# Altium schematic sheet V1.0.SchDoc
size 147 x 241 mm; Origin: Eagle
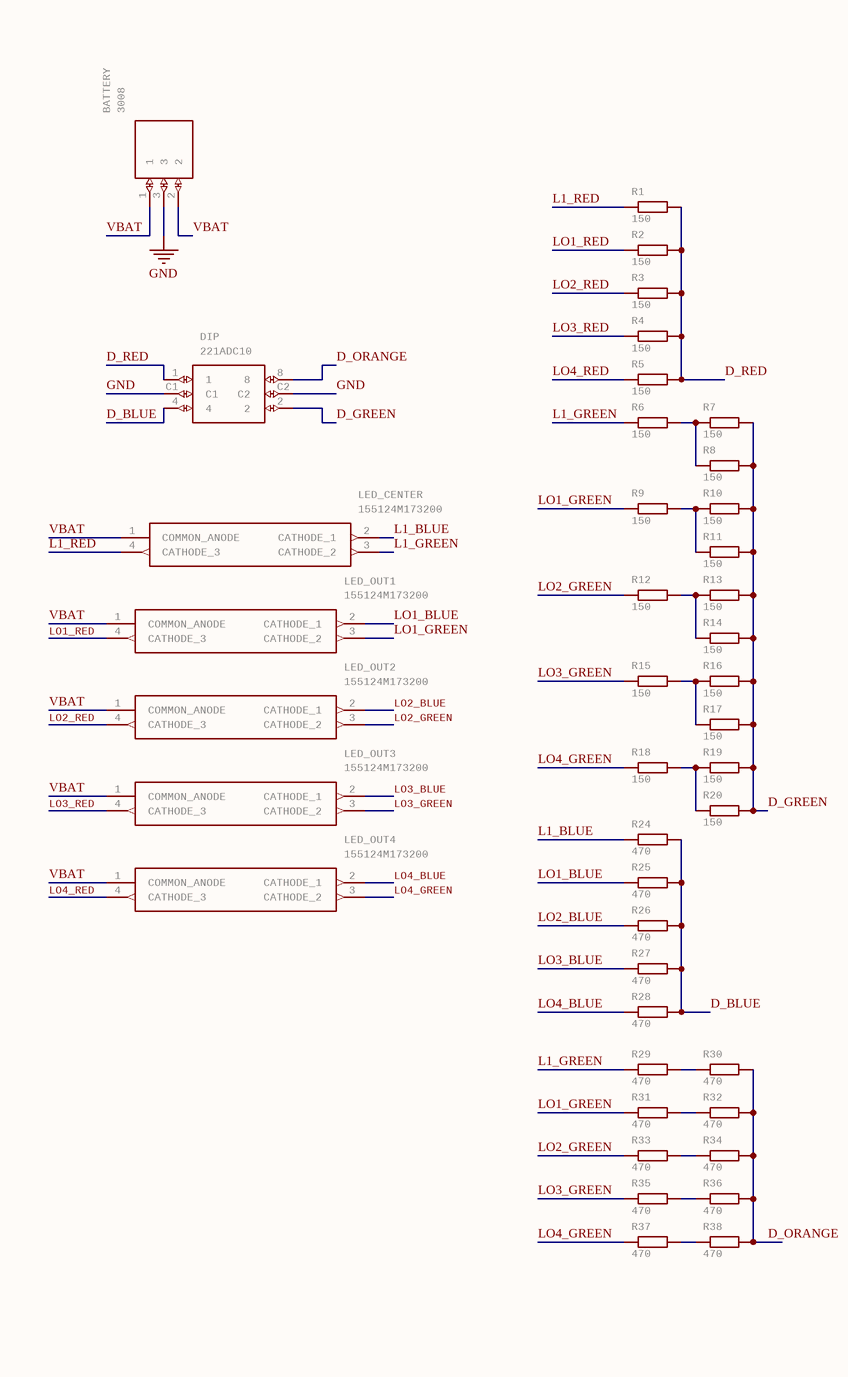
[diagram p0: V1.0.SchDoc]

## Parts
BATTERY  3008  [3008]
DIP  221ADC10  [221ADC10]
LED_CENTER  155124M173200  [155124M173200]
LED_OUT1  155124M173200  [155124M173200]
LED_OUT2  155124M173200  [155124M173200]
LED_OUT3  155124M173200  [155124M173200]
LED_OUT4  155124M173200  [155124M173200]
R1  150  [R0603]
R2  150  [R0603]
R3  150  [R0603]
R4  150  [R0603]
R5  150  [R0603]
R6  150  [R0603]
R7  150  [R0603]
R8  150  [R0603]
R9  150  [R0603]
R10  150  [R0603]
R11  150  [R0603]
R12  150  [R0603]
R13  150  [R0603]
R14  150  [R0603]
R15  150  [R0603]
R16  150  [R0603]
R17  150  [R0603]
R18  150  [R0603]
R19  150  [R0603]
R20  150  [R0603]
R24  470  [R0603]
R25  470  [R0603]
R26  470  [R0603]
R27  470  [R0603]
R28  470  [R0603]
R29  470  [R0603]
R30  470  [R0603]
R31  470  [R0603]
R32  470  [R0603]
R33  470  [R0603]
R34  470  [R0603]
R35  470  [R0603]
R36  470  [R0603]
R37  470  [R0603]
R38  470  [R0603]

## Nets
GND: BATTERY.3 DIP.C1 DIP.C2
D_BLUE: DIP.4 R24.2 R25.2 R26.2 R27.2 R28.2
D_GREEN: DIP.2 R7.2 R8.2 R10.2 R11.2 R13.2 R14.2 R16.2 R17.2 R19.2 R20.2
D_ORANGE: DIP.8 R30.2 R32.2 R34.2 R36.2 R38.2
D_RED: DIP.1 R1.2 R2.2 R3.2 R4.2 R5.2
L1_BLUE: LED_CENTER.2(CATHODE_1) R24.1
L1_GREEN: LED_CENTER.3(CATHODE_2) R6.1 R29.1
L1_RED: LED_CENTER.4(CATHODE_3) R1.1
LO1_BLUE: LED_OUT1.2(CATHODE_1) R25.1
LO1_GREEN: LED_OUT1.3(CATHODE_2) R9.1 R31.1
LO1_RED: LED_OUT1.4(CATHODE_3) R2.1
LO2_BLUE: LED_OUT2.2(CATHODE_1) R26.1
LO2_GREEN: LED_OUT2.3(CATHODE_2) R12.1 R33.1
LO2_RED: LED_OUT2.4(CATHODE_3) R3.1
LO3_BLUE: LED_OUT3.2(CATHODE_1) R27.1
LO3_GREEN: LED_OUT3.3(CATHODE_2) R15.1 R35.1
LO3_RED: LED_OUT3.4(CATHODE_3) R4.1
LO4_BLUE: LED_OUT4.2(CATHODE_1) R28.1
LO4_GREEN: LED_OUT4.3(CATHODE_2) R18.1 R37.1
LO4_RED: LED_OUT4.4(CATHODE_3) R5.1
VBAT: BATTERY.1 BATTERY.2 LED_CENTER.1(COMMON_ANODE) LED_OUT1.1(COMMON_ANODE) LED_OUT2.1(COMMON_ANODE) LED_OUT3.1(COMMON_ANODE) LED_OUT4.1(COMMON_ANODE)
NetR6_2: R6.2 R7.1 R8.1
NetR9_2: R9.2 R10.1 R11.1
NetR12_2: R12.2 R13.1 R14.1
NetR15_2: R15.2 R16.1 R17.1
NetR18_2: R18.2 R19.1 R20.1
NetR29_2: R29.2 R30.1
NetR31_2: R31.2 R32.1
NetR33_2: R33.2 R34.1
NetR35_2: R35.2 R36.1
NetR37_2: R37.2 R38.1

## Library data of the parts
BATTERY = 3008: BATTERY SOCKET   Source:  Datasheet; MANUFACTURER_NAME: Keystone Electronics; GateName_1: G$1; SymbolName_1: 3008; LibraryName: SamacSys_Parts; DeviceSetName: 3008; ARROW_PART_NUMBER: 3008; ARROW_PRICE-STOCK: https://www.arrow.com/en/products/3008/keystone-electronics; HEIGHT: 5mm; MANUFACTURER_PART_NUMBER: 3008; MOUSER_PART_NUMBER: 534-3008; MOUSER_PRICE-STOCK: https://www.mouser.co.uk/ProductDetail/Keystone-Electronics/3008?qs=Mn60vILZNNaVxpUY7xQk0w%3D%3D
DIP = 221ADC10: SWITCH ROTARY DIP BCD 100MA 50V   Source:  Datasheet; MANUFACTURER_NAME: CTS; GateName_1: G$1; SymbolName_1: 221ADC10; LibraryName: SamacSys_Parts; DeviceSetName: 221ADC10; HEIGHT: 12.06mm; MANUFACTURER_PART_NUMBER: 221ADC10; RS_PART_NUMBER: 1234573; RS_PRICE-STOCK: http://uk.rs-online.com/web/p/products/1234573
LED_CENTER LED_OUT1-LED_OUT4 = 155124M173200: WURTH ELEKTRONIK - 155124M173200 - LED, RED/GRN/BLUE, 450/850/140MCD, 1204   Source:  Datasheet; GateName_1: G$1; SymbolName_1: 155124M173200; LibraryName: SamacSys_Parts; DeviceSetName: 155124M173200; ARROW_PART_NUMBER: ARROW_PART_NUMBER; ARROW_PRICE-STOCK: ARROW_PRICE-STOCK; HEIGHT: mm; MANUFACTURER_NAME: Wurth Elektronik; MANUFACTURER_PART_NUMBER: 155124M173200; MOUSER_PART_NUMBER: 710-155124M173200; MOUSER_PRICE-STOCK: https://www.mouser.co.uk/ProductDetail/Wurth-Elektronik/155124M173200?qs=5aG0NVq1C4xPhoUU07x4gQ%3D%3D
R1-R20 R24-R38 = R-EU_R0603: RESISTOR, European symbol; GateName_1: G$1; SymbolName_1: R-EU; DeviceSetName: R-EU_; POPULARITY: 70; DeviceName: R0603; LibraryName: rcl; SPICEPREFIX: R